# EAGLE board EPAPER133_V2 (EAGLE 9.7.0), part 1 of 2
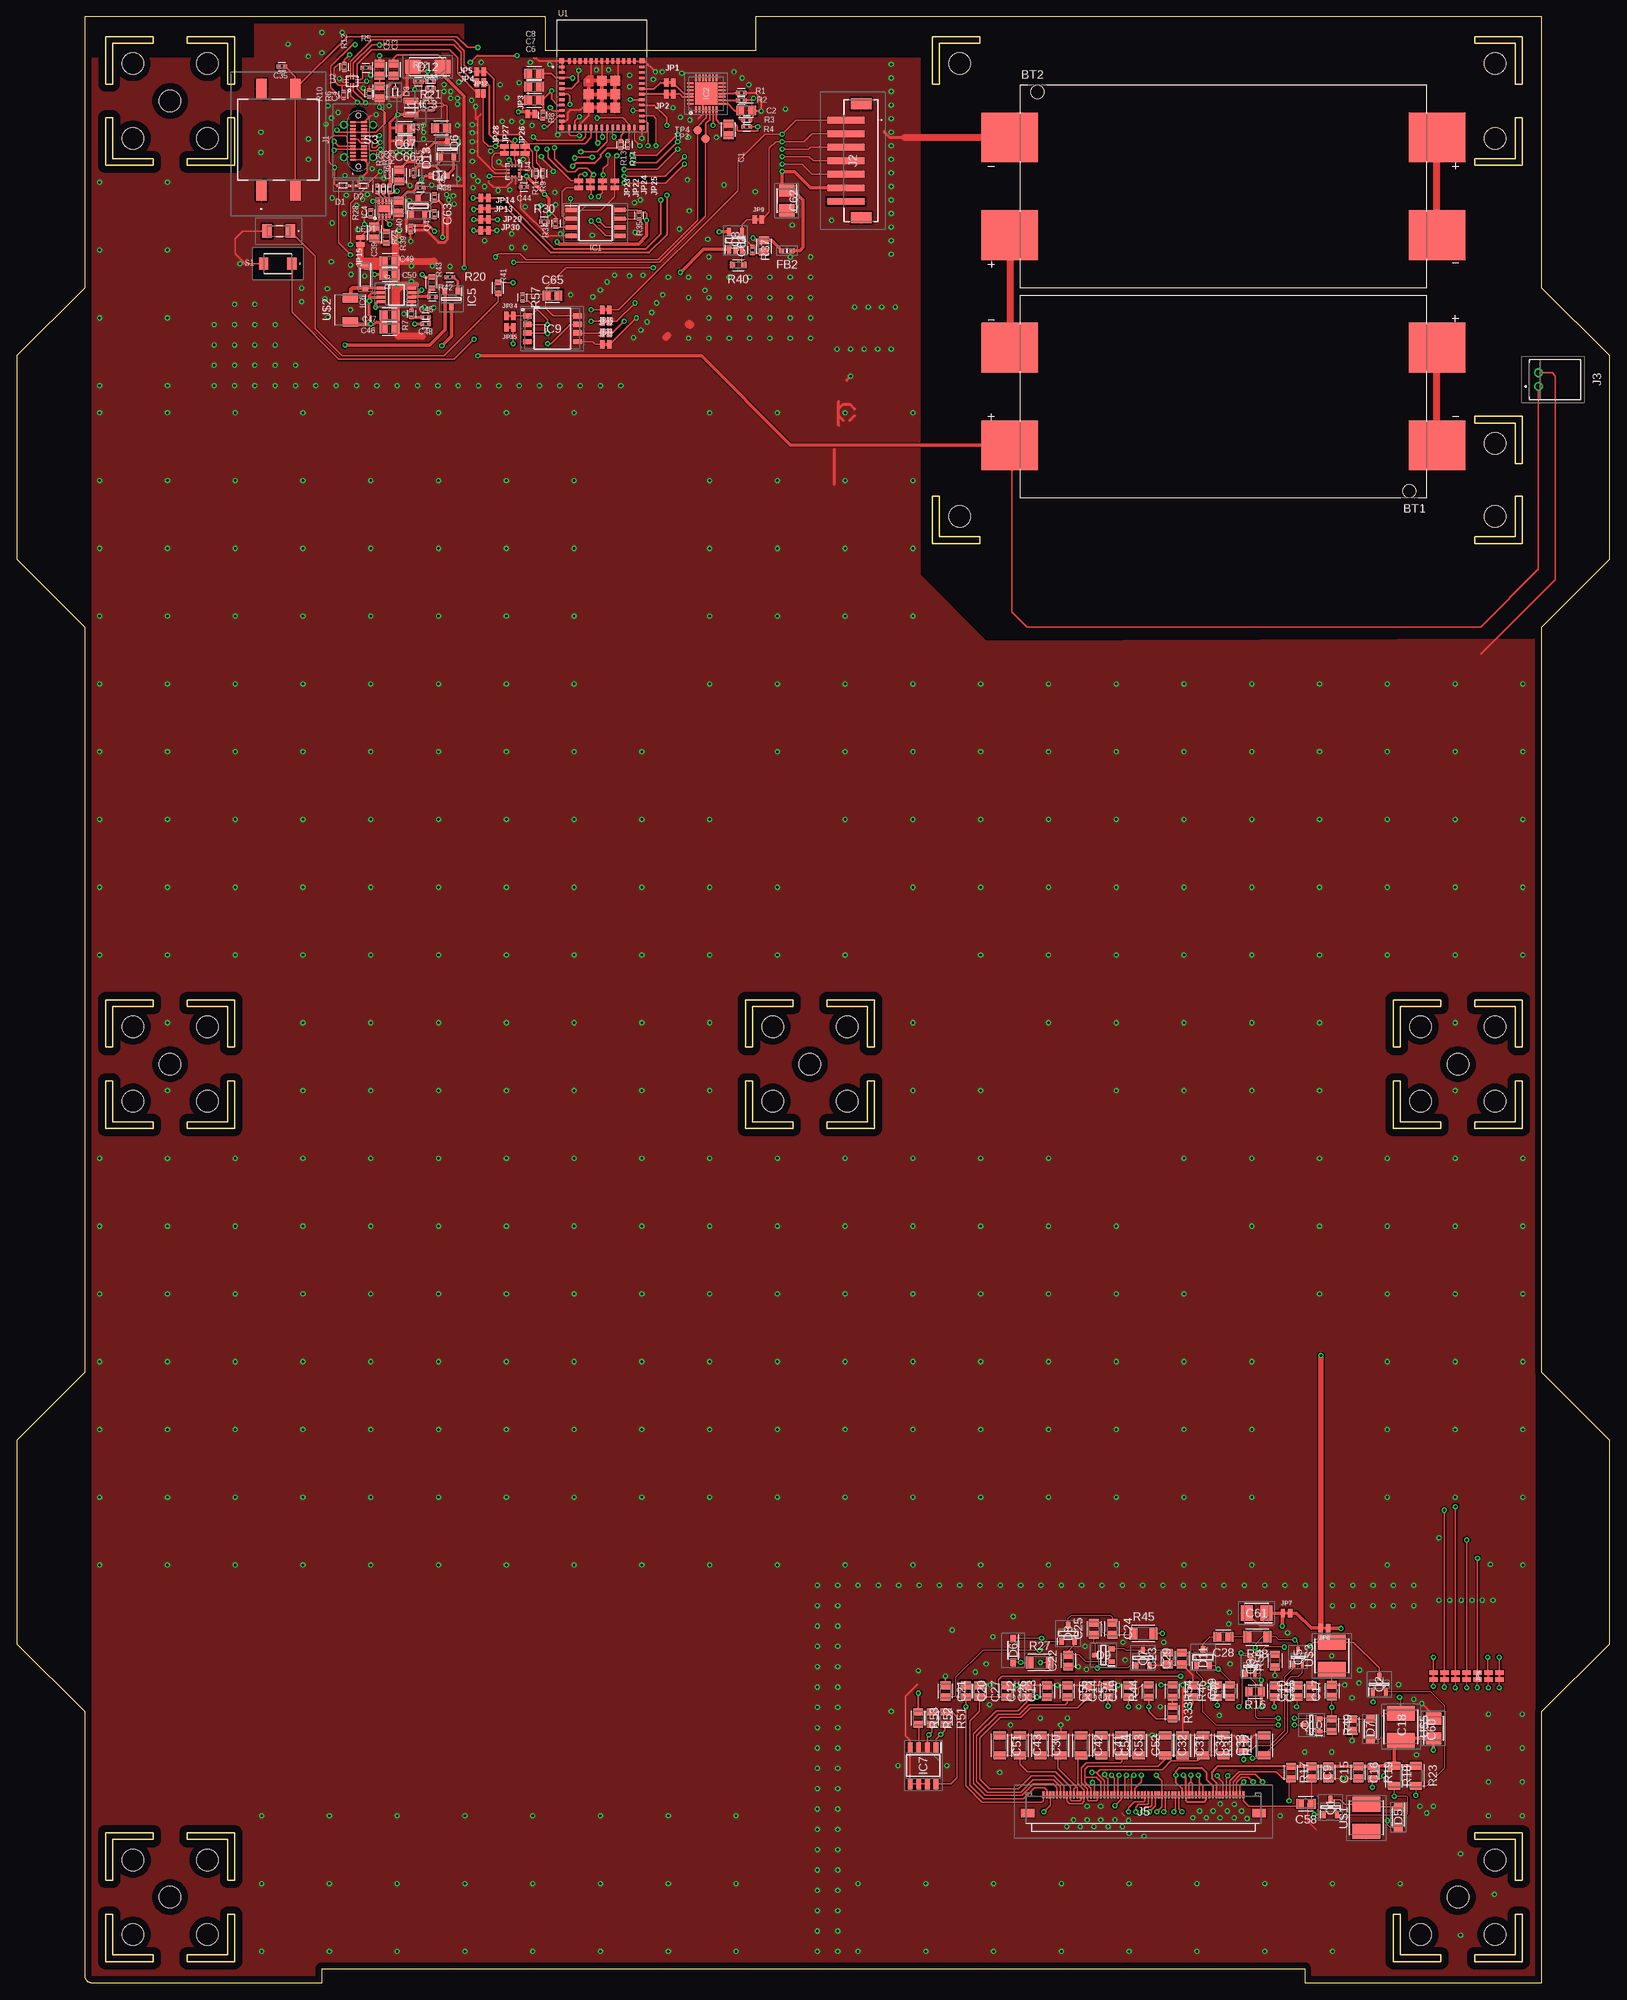
[diagram p2: board, top side]
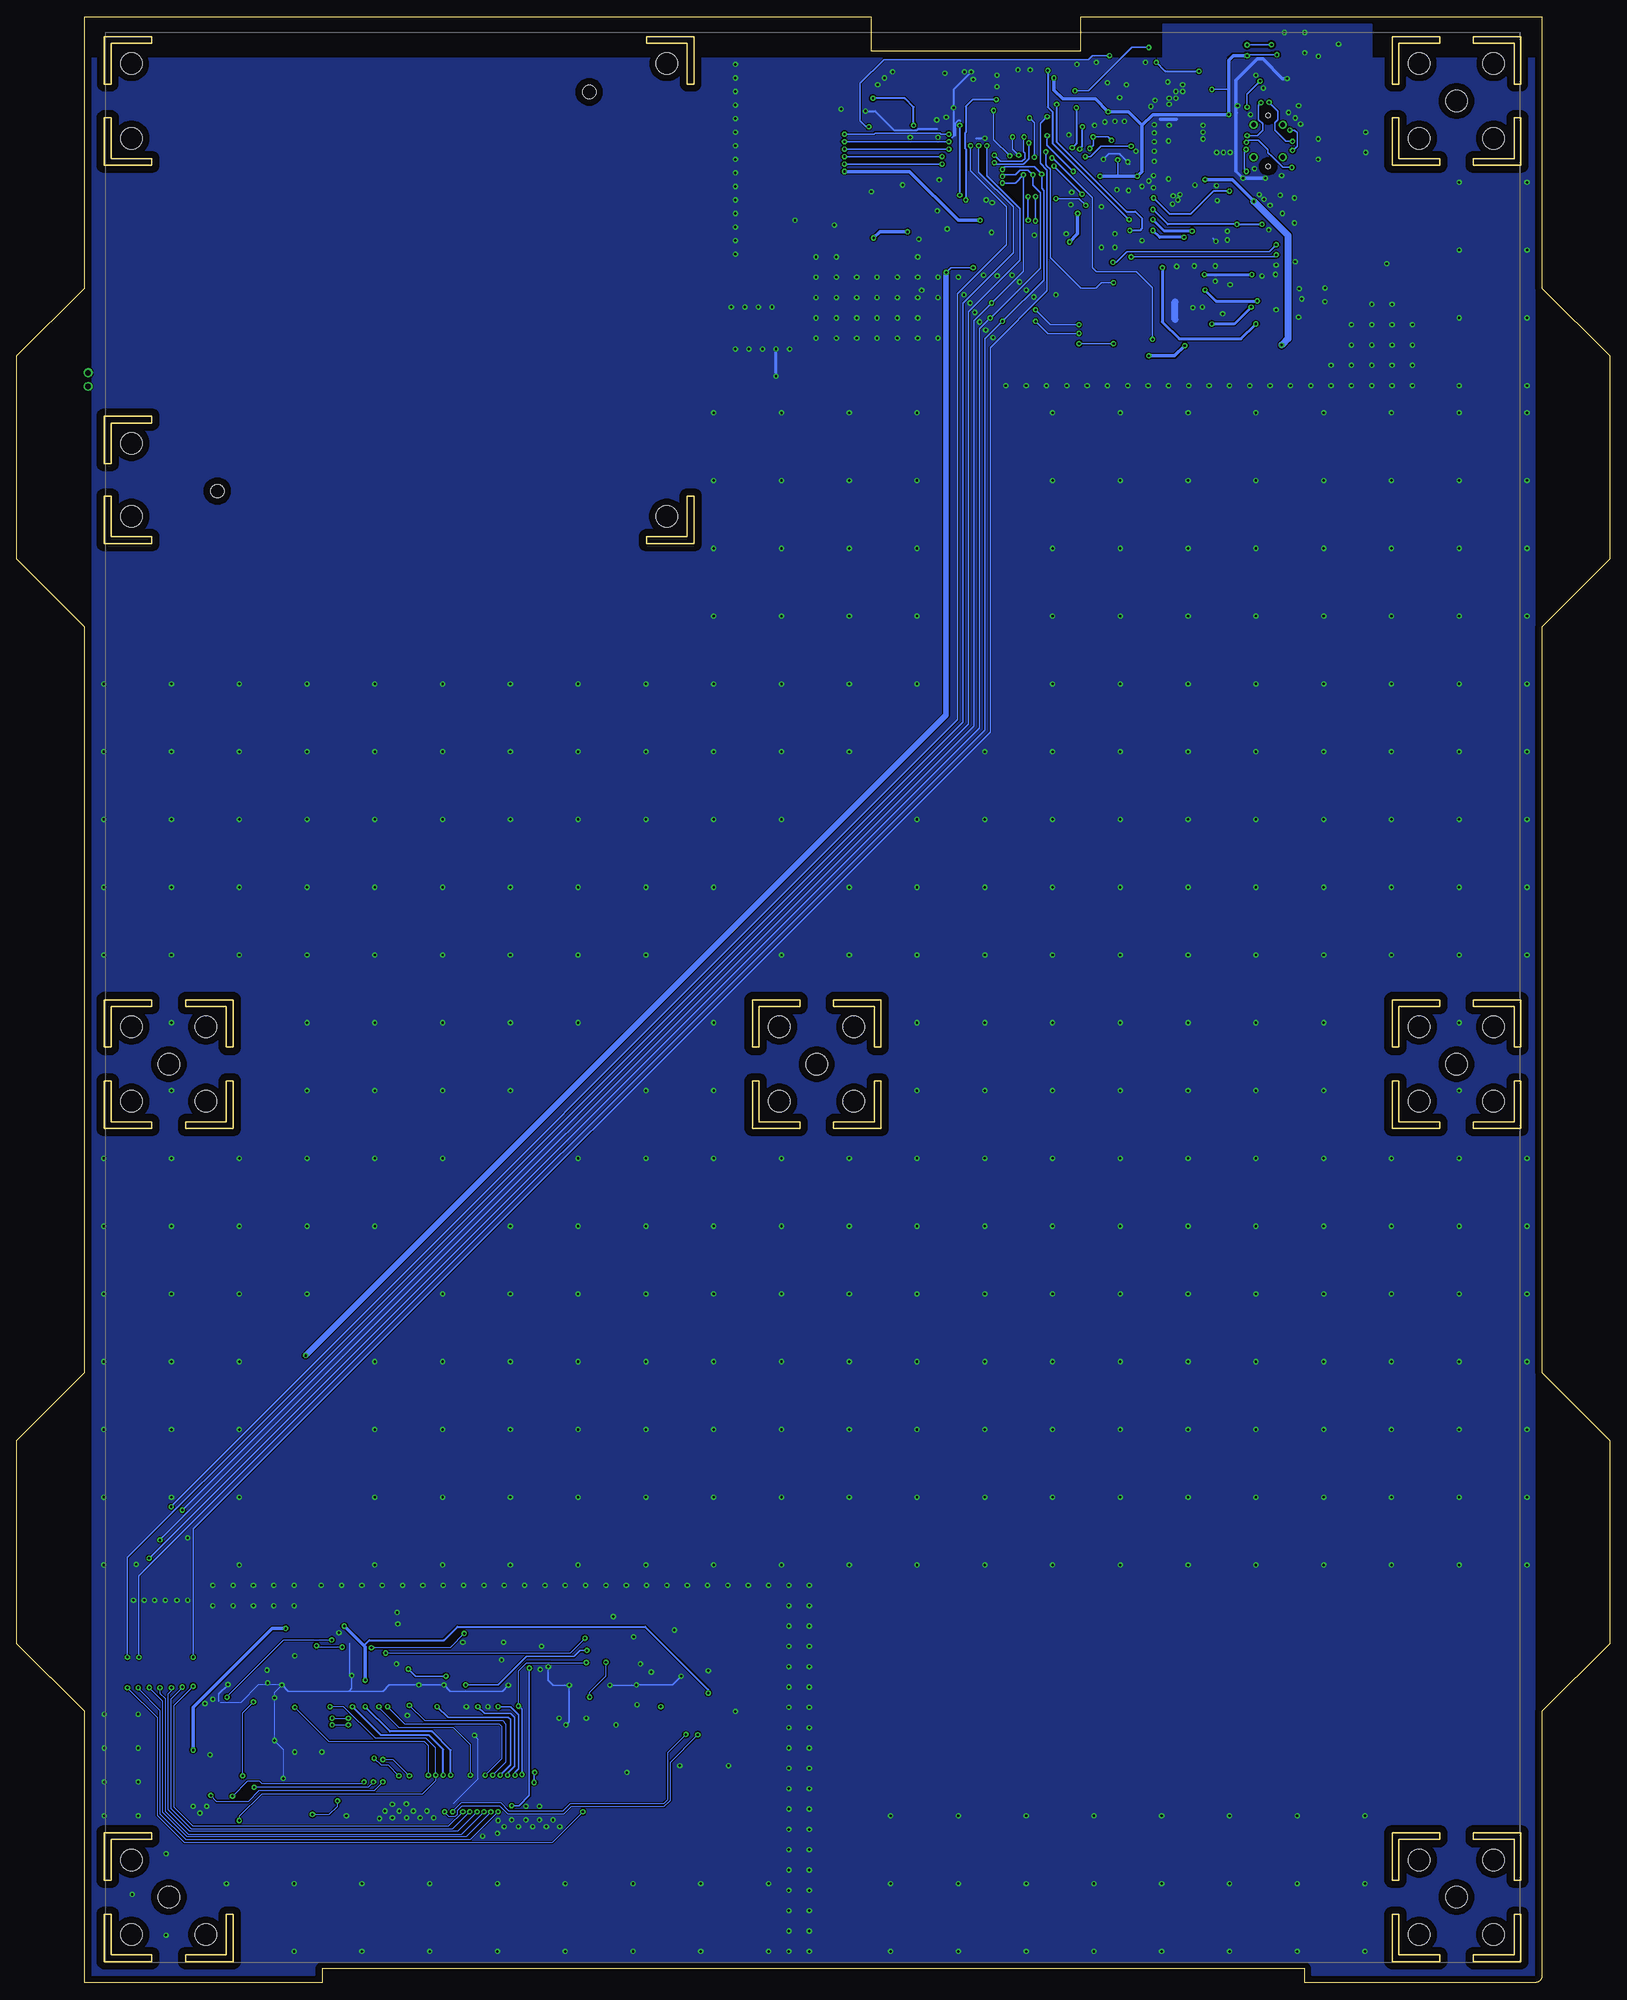
[diagram p3: board, bottom side, seen from below]

Size 235 x 290 mm. Coordinates in mm from the lower left corner, seen from the top.
Outline: 10,290 10,250 0,240 0,210 10,200 10,90 0,80 0,50 10,40 10,1 arc90 11,0 45,0 45,2 190,2 190,0 225,0 225,40 235,50 235,80 225,90 225,200 235,210 235,240 225,250 225,290 109,290 109,285 78,285 78,290 10,290
Outline: 107.5,145 114.5,145 114.5,144 108.5,144 108.5,138 107.5,138 107.5,145
Outline: 107.5,126 107.5,133 108.5,133 108.5,127 114.5,127 114.5,126 107.5,126
Outline: 126.5,145 126.5,138 125.5,138 125.5,144 119.5,144 119.5,145 126.5,145
Outline: 126.5,126 119.5,126 119.5,127 125.5,127 125.5,133 126.5,133 126.5,126
Outline: 32.1,22.1 32.1,15.1 31.1,15.1 31.1,21.1 25.1,21.1 25.1,22.1 32.1,22.1
Outline: 13.1,22.1 20.1,22.1 20.1,21.1 14.1,21.1 14.1,15.1 13.1,15.1 13.1,22.1
Outline: 32.1,3.1 25.1,3.1 25.1,4.1 31.1,4.1 31.1,10.1 32.1,10.1 32.1,3.1
Outline: 13.1,3.1 13.1,10.1 14.1,10.1 14.1,4.1 20.1,4.1 20.1,3.1 13.1,3.1
Outline: 222.1,22.1 222.1,15.1 221.1,15.1 221.1,21.1 215.1,21.1 215.1,22.1 222.1,22.1
Outline: 222.1,3.1 215.1,3.1 215.1,4.1 221.1,4.1 221.1,10.1 222.1,10.1 222.1,3.1
Outline: 203.1,3.1 203.1,10.1 204.1,10.1 204.1,4.1 210.1,4.1 210.1,3.1 203.1,3.1
Outline: 32.1,287.1 32.1,280.1 31.1,280.1 31.1,286.1 25.1,286.1 25.1,287.1 32.1,287.1
Outline: 13.1,287.1 20.1,287.1 20.1,286.1 14.1,286.1 14.1,280.1 13.1,280.1 13.1,287.1
Outline: 32.1,268.1 25.1,268.1 25.1,269.1 31.1,269.1 31.1,275.1 32.1,275.1 32.1,268.1
Outline: 13.1,268.1 13.1,275.1 14.1,275.1 14.1,269.1 20.1,269.1 20.1,268.1 13.1,268.1
Outline: 135.1,287.1 142.1,287.1 142.1,286.1 136.1,286.1 136.1,280.1 135.1,280.1 135.1,287.1
Outline: 222.1,268.1 215.1,268.1 215.1,269.1 221.1,269.1 221.1,275.1 222.1,275.1 222.1,268.1
Outline: 222.1,287.1 222.1,280.1 221.1,280.1 221.1,286.1 215.1,286.1 215.1,287.1 222.1,287.1
Outline: 222.1,212.3 215.1,212.3 215.1,213.3 221.1,213.3 221.1,219.3 222.1,219.3 222.1,212.3
Outline: 135.1,212.3 135.1,219.3 136.1,219.3 136.1,213.3 142.1,213.3 142.1,212.3 135.1,212.3
Outline: 13.1,145 20.1,145 20.1,144 14.1,144 14.1,138 13.1,138 13.1,145
Outline: 13.1,126 13.1,133 14.1,133 14.1,127 20.1,127 20.1,126 13.1,126
Outline: 32.1,145 32.1,138 31.1,138 31.1,144 25.1,144 25.1,145 32.1,145
Outline: 32.1,126 25.1,126 25.1,127 31.1,127 31.1,133 32.1,133 32.1,126
Outline: 203.1,145 210.1,145 210.1,144 204.1,144 204.1,138 203.1,138 203.1,145
Outline: 203.1,126 203.1,133 204.1,133 204.1,127 210.1,127 210.1,126 203.1,126
Outline: 222.1,145 222.1,138 221.1,138 221.1,144 215.1,144 215.1,145 222.1,145
Outline: 222.1,126 215.1,126 215.1,127 221.1,127 221.1,133 222.1,133 222.1,126
Outline: 222.1,231.1 222.1,224.1 221.1,224.1 221.1,230.1 215.1,230.1 215.1,231.1 222.1,231.1
Copper layers (1*16): Top / Bottom
Stack-up Default Layer Stack: Top User Defined 0.035mm / Dielectric-1 User Defined 1.5mm / Bottom User Defined 0.035mm
Design rules: minimum copper width 6mil, minimum drill size 0.35mm, copper clearance wire_polygon to wire_polygon 6mil, copper clearance wire_polygon to pad_smd 6mil, copper clearance wire_polygon to via 0.15mm, copper clearance pad_smd to pad_smd 6mil, copper clearance pad_smd to via 6mil, copper clearance via to via 6mil, copper clearance smd to pad (same net) 6mil, copper clearance smd to via (same net) 6mil, copper clearance smd to smd (same net) 6mil, dimension clearance 40mil, via restrict clearance 0mil, restrict clearance 0mil, drill distance 6mil, keepout clearance 0mil
Holes 3.2 mm at 111.5,141 122.5,141 122.5,130 111.5,130 117,135.5 28.1,18.1 28.1,7.1 17.1,7.1 17.1,18.1 22.6,12.6 218.1,18.1 218.1,7.1 207.1,7.1 212.6,12.6 28.1,283.1 28.1,272.1 17.1,272.1 17.1,283.1 22.6,277.6 139.1,283.1 218.1,283.1 218.1,272.1 218.1,216.3 139.1,216.3 17.1,141 28.1,141 28.1,130 17.1,130 22.6,135.5 207.1,141 218.1,141 218.1,130 207.1,130 212.6,135.5 218.1,227.1

## Footprints (pad centres in the part's own frame; a part is rotated, then mirrored left to right if it is on the bottom)
BAT_1012 = smd 8.34 x 7.35: N1 -31.5,7.21; N2 31.5,-7.21; P1 31.5,7.21; P2 -31.5,-7.21 | hole 1.98: -27.435,13.94
CAPC2012X110 = smd 1.165 x 1.465: 1 -0.875,0; 2 0.875,0
CAPC3216X135 = smd 1.165 x 1.815: 1 -1.475,0; 2 1.475,0
CAPC1005X60 = smd 0.56 x 0.629: 1 -0.485,0; 2 0.485,0
CAPPM3528X210N = smd 1.8 x 2.3: 1 -1.45,0; 2 1.45,0
LESD5D50CT1G = smd 0.48 x 0.4: 1 -0.66,0; 2 0.66,0
CUS357H3F = smd 0.8 x 0.9: 1 -1.15,0; 2 1.15,0
SODFL3518X115N = smd 1.12 x 1.37: 1 -1.5,0; 2 1.5,0
SOD3716X135N = smd 1.15 x 0.8: 1 -1.75,0; 2 1.75,0
SOT95P240X120-3N = smd 1 x 0.7: 1 -1.2,0.95; 2 -1.2,-0.95; 3 1.2,0
SODFL3516X120N = smd 0.82 x 0.76: 1 -1.6,0; 2 1.6,0
DIOM5327X244N = smd 2.3 x 2.05: 1 -2.2,0; 2 2.2,0
BLM18SP221SN1B = smd 0.75 x 0.7: 1 -0.775,0; 2 0.775,0
SOIC127P790X216-8N = smd 1.65 x 0.65: 1 -3.6,1.905; 2 -3.6,0.635; 3 -3.6,-0.635; 4 -3.6,-1.905; 5 3.6,-1.905; 6 3.6,-0.635; 7 3.6,0.635; 8 3.6,1.905
QFN50P500X500X80-29N = smd 1 x 0.3: 1 -2.35,1.5; 2 -2.35,1; 3 -2.35,0.5; 4 -2.35,0; 5 -2.35,-0.5; 6 -2.35,-1; 7 -2.35,-1.5; 15 2.35,-1.5; 16 2.35,-1; 17 2.35,-0.5; 18 2.35,0; 19 2.35,0.5; 20 2.35,1; 21 2.35,1.5 | smd 0.3 x 1: 8 -1.5,-2.35; 9 -1,-2.35; 10 -0.5,-2.35; 11 0,-2.35; 12 0.5,-2.35; 13 1,-2.35; 14 1.5,-2.35; 22 1.5,2.35; 23 1,2.35; 24 0.5,2.35; 25 0,2.35; 26 -0.5,2.35; 27 -1,2.35; 28 -1.5,2.35 | smd 3.35 x 3.35: 29 0,0
TPS62902RPJR = smd 0.65 x 0.2: 1 -0.625,0.25; 2 -0.625,-0.25; 3 -0.625,-0.75; 5 0.625,-0.25 | smd 1 x 0.2: 4 0.45,-0.75; 6 0.45,0.25 | smd 0.25 x 0.55: 7 0.5,0.925; 8 0,0.925; 9 -0.5,0.925
SON50P200X200X80-9N = smd 0.7 x 0.3: 1 -1.05,0.75; 2 -1.05,0.25; 3 -1.05,-0.25; 4 -1.05,-0.75; 5 1.05,-0.75; 6 1.05,-0.25; 7 1.05,0.25; 8 1.05,0.75 | smd 1 x 1.7: 9 0,0
SOT96P240X115-3N = smd 1.15 x 0.6: 1 -1.1,0.96; 2 -1.1,-0.96; 3 1.1,0
SOP65P490X110-8N = smd 1.4 x 0.45: 1 -2.2,0.975; 2 -2.2,0.325; 3 -2.2,-0.325; 4 -2.2,-0.975; 5 2.2,-0.975; 6 2.2,-0.325; 7 2.2,0.325; 8 2.2,0.975
SOIC127P600X175-8N = smd 1.55 x 0.7: 1 -2.7,1.905; 2 -2.7,0.635; 3 -2.7,-0.635; 4 -2.7,-1.905; 5 2.7,-1.905; 6 2.7,-0.635; 7 2.7,0.635; 8 2.7,1.905
SOT95P280X135-5N = smd 1.25 x 0.6: 1 -1.3,0.95; 2 -1.3,0; 3 -1.3,-0.95; 4 1.3,-0.95; 5 1.3,0.95
SON127P800X600X80-8N = smd 1.3 x 0.8: 1 -3.7,1.905; 2 -3.7,0.635; 3 -3.7,-0.635; 4 -3.7,-1.905; 5 3.7,-1.905; 6 3.7,-0.635; 7 3.7,0.635; 8 3.7,1.905
U263241N4BQC02 = smd 0.3 x 0.85: A1 -2.75,0.835; A2 -2.25,0.835; A3 -1.75,0.835; A4 -1.25,0.835; A5 -0.75,0.835; A6 -0.25,0.835; A7 0.25,0.835; A8 0.75,0.835; A9 1.25,0.835; A10 1.75,0.835; A11 2.25,0.835; A12 2.75,0.835; B1 2.75,-0.835; B2 2.25,-0.835; B3 1.75,-0.835; B4 1.25,-0.835; B5 0.75,-0.835; B6 0.25,-0.835; B7 -0.25,-0.835; B8 -0.75,-0.835; B9 -1.25,-0.835; B10 -1.75,-0.835; B11 -2.25,-0.835; B12 -2.75,-0.835 | drill 0.7 pad 1.1: MH1 -2.4,2.15; MH2 2.4,2.15; MH3 2.4,-2.15; MH4 -2.4,-2.15 | hole 0.66: -3.75,0; 3.75,0
B7BPHSM4TBLFSN = smd 1 x 5.5: 1 6,2.75; 2 4,2.75; 3 2,2.75; 4 0,2.75; 5 -2,2.75; 6 -4,2.75; 7 -6,2.75 | smd 1.6 x 3: 8 8.4,0.5; 9 -8.4,0.5
S2BPHKS = drill 0.8 pad 1.3: 1 0,0; 2 -2,0
5051106091 = smd 0.3 x 1: 1 -14.75,2.1; 2 -14.25,2.1; 3 -13.75,2.1; 4 -13.25,2.1; 5 -12.75,2.1; 6 -12.25,2.1; 7 -11.75,2.1; 8 -11.25,2.1; 9 -10.75,2.1; 10 -10.25,2.1; 11 -9.75,2.1; 12 -9.25,2.1; 13 -8.75,2.1; 14 -8.25,2.1; 15 -7.75,2.1; 16 -7.25,2.1; 17 -6.75,2.1; 18 -6.25,2.1; 19 -5.75,2.1; 20 -5.25,2.1; 21 -4.75,2.1; 22 -4.25,2.1; 23 -3.75,2.1; 24 -3.25,2.1; 25 -2.75,2.1; 26 -2.25,2.1; 27 -1.75,2.1; 28 -1.25,2.1; 29 -0.75,2.1; 30 -0.25,2.1; 31 0.25,2.1; 32 0.75,2.1; 33 1.25,2.1; 34 1.75,2.1; 35 2.25,2.1; 36 2.75,2.1; 37 3.25,2.1; 38 3.75,2.1; 39 4.25,2.1; 40 4.75,2.1; 41 5.25,2.1; 42 5.75,2.1; 43 6.25,2.1; 44 6.75,2.1; 45 7.25,2.1; 46 7.75,2.1; 47 8.25,2.1; 48 8.75,2.1; 49 9.25,2.1; 50 9.75,2.1; 51 10.25,2.1; 52 10.75,2.1; 53 11.25,2.1; 54 11.75,2.1; 55 12.25,2.1; 56 12.75,2.1; 57 13.25,2.1; 58 13.75,2.1; 59 14.25,2.1; 60 14.75,2.1 | smd 2 x 1.3: MP1 -17.05,-0.6; MP2 17.05,-0.6
SMT-JUMPER_2_NC_TRACE_NO-SILK = smd 0.66 x 1.27: 1 -0.521,0; 2 0.521,0
SMT-JUMPER_2_NO_NO-SILK = smd 0.635 x 1.27: 1 -0.406,0; 2 0.406,0
DFE2HCAH1R0MJ0L = smd 0.85 x 2.2: 1 -1.025,0; 2 1.025,0
KPTD3216SGC = smd 1.4 x 2: 1 -1.7,0; 2 1.7,0
SOT65P210X110-3N = smd 1 x 0.5: 1 -1,0.65; 2 -1,-0.65; 3 1,0
SOT96P240X110-3N = smd 1.1 x 0.65: 1 -1.05,0.96; 2 -1.05,-0.96; 3 1.05,0
SOT95P230X110-3N = smd 1.05 x 0.6: 1 -1.1,0.95; 2 -1.1,-0.95; 3 1.1,0
RESC1005X40 = smd 0.535 x 0.644: 1 -0.507,0; 2 0.507,0
RESC2012X65 = smd 1.031 x 1.42: 1 -0.919,0; 2 0.919,0
RESC3216X70 = smd 1.165 x 1.815: 1 -1.475,0; 2 1.475,0
RESC1608X60 = smd 0.799 x 0.974: 1 -0.815,0; 2 0.815,0
TS1088AR02016 = smd 1.35 x 1.8: 1 -2.075,0; 2 2.075,0
TS1103SCU = smd 3 x 1.5: 1 -7.5,2.5; 2 7.5,2.5; 3 -7.5,-2.5; 4 7.5,-2.5
B1,27 = smd 1.27 x 1.27: TP 0,0
XCVR_ESP32-C6-MINI-1-N4 = smd 0.8 x 0.4: 1 -5.9,4; 2 -5.9,3.2; 3 -5.9,2.4; 4 -5.9,1.6; 5 -5.9,0.8; 6 -5.9,0; 7 -5.9,-0.8; 8 -5.9,-1.6; 9 -5.9,-2.4; 10 -5.9,-3.2; 11 -5.9,-4; 25 5.9,-4; 26 5.9,-3.2; 27 5.9,-2.4; 28 5.9,-1.6; 29 5.9,-0.8; 30 5.9,0; 31 5.9,0.8; 32 5.9,1.6; 33 5.9,2.4; 34 5.9,3.2; 35 5.9,4 | smd 0.4 x 0.8: 12 -4.8,-4.9; 13 -4,-4.9; 14 -3.2,-4.9; 15 -2.4,-4.9; 16 -1.6,-4.9; 17 -0.8,-4.9; 18 0,-4.9; 19 0.8,-4.9; 20 1.6,-4.9; 21 2.4,-4.9; 22 3.2,-4.9; 23 4,-4.9; 24 4.8,-4.9; 36 4.8,4.9; 37 4,4.9; 38 3.2,4.9; 39 2.4,4.9; 40 1.6,4.9; 41 0.8,4.9; 42 0,4.9; 43 -0.8,4.9; 44 -1.6,4.9; 45 -2.4,4.9; 46 -3.2,4.9; 47 -4,4.9; 48 -4.8,4.9 | smd 0.4 x 0.4: 49_1 -1.975,1.975 | smd 1.45 x 1.45: 49_2 0,1.975; 49_3 1.975,1.975; 49_4 -1.975,0; 49_5 0,0; 49_6 1.975,0; 49_7 -1.975,-1.975; 49_8 0,-1.975; 49_9 1.975,-1.975 | smd 0.7 x 0.7: 50 5.95,4.95; 51 5.95,-4.95; 52 -5.95,-4.95; 53 -5.95,4.95
X2QFN12 = smd 0.7 x 0.2: 1 -0.65,0.2; 2 -0.65,-0.2; 7 0.65,-0.2; 8 0.65,0.2 | smd 0.2 x 0.5: 3 -0.6,-0.75; 4 -0.2,-0.75; 5 0.2,-0.75; 6 0.6,-0.75; 9 0.6,0.75; 10 0.2,0.75; 11 -0.2,0.75; 12 -0.6,0.75
KIONIX_KXTJ3-1057 = smd 0.275 x 0.25: 1 -0.762,0.75; 2 -0.762,0.25; 3 -0.762,-0.25; 4 -0.762,-0.75; 7 0.762,-0.75; 8 0.762,-0.25; 9 0.762,0.25; 10 0.762,0.75 | smd 0.25 x 0.275: 5 -0.25,-0.762; 6 0.25,-0.762; 11 0.25,0.762; 12 -0.25,0.762
INDPM5050X400N = smd 2.2 x 4.1: 1 -2,0; 2 2,0
SL0420-3R3M = smd 1.4 x 2.3: 1 -1.775,0; 2 1.775,0

## Placement (x,y rotation side)
BT1  1012  [BAT_1012]  178,234 180 top
BT2  1012  [BAT_1012]  178,265 0 top
C1  10uF 25V 0805  [CAPC2012X110]  105,273.4 270 top
C2  1uF 25V 0805  [CAPC2012X110]  107.6,276.2 0 top
C3  10uF 25V 0805  [CAPC2012X110]  55.6,282.2 270 top
C4  4.7uF 25V 0805  [CAPC2012X110]  53.5,278.9 90 top
C5  4.7uF 25V 0805  [CAPC2012X110]  53.5,282.2 270 top
C6  1uF 25V 0805  [CAPC2012X110]  76.3,277.7 180 top
C7  100nF 50V 0805  [CAPC2012X110]  76.3,279.7 0 top
C8  10uF 25V 0805  [CAPC2012X110]  76.3,281.6 0 top
C9  4.7uF 25V 0805  [CAPC2012X110]  191,31 270 top
C10  10uF 50V 0805  [CAPC2012X110]  188.9,43 90 top
C11  100nF 50V 0805  [CAPC2012X110]  191,43 90 top
C12  10uF 50V 0805  [CAPC2012X110]  149,43 90 top
C13  100nF 50V 0805  [CAPC2012X110]  152,43 90 top
C14  100nF 50V 0805  [CAPC2012X110]  161,43 90 top
C15  4.7uF 25V 0805  [CAPC2012X110]  193.5,31 270 top
C16  4.7uF 25V 0805  [CAPC2012X110]  197.9,31 270 top
C17  10uF 50V 0805  [CAPC2012X110]  194,43.07 90 top
C18  100nF 50V 0805  [CAPC2012X110]  197,38 270 top
C19  1uF 50V 0805  [CAPC2012X110]  164,43 90 top
C20  100nF 50V 0805  [CAPC2012X110]  140,43 270 top
C21  4.7uF 50V 0805  [CAPC2012X110]  137,43 270 top
C22  1uF 50V 0805  [CAPC2012X110]  155.1,47.5 90 top
C23  47nF 50V 0805  [CAPC2012X110]  169.8,47.8 90 top
C24  470nF 50V 0805  [CAPC2012X110]  161.6,52.2 270 top
C25  470nF 50V 0805  [CAPC2012X110]  158.9,52.2 90 top
C26  100nF 50V 0805  [CAPC2012X110]  146,43 270 top
C27  4.7uF 25V 0805  [CAPC2012X110]  142,43 270 top
C28  470nF 50V 0805  [CAPC2012X110]  178,51 180 top
C29  220nF 50V 0805  [CAPC2012X110]  171.9,47.8 90 top
C30  22uF 25V 1206  [CAPC3216X135]  151,35 270 top
C31  22uF 25V 1206  [CAPC3216X135]  172,35 270 top
C32  22uF 25V 1206  [CAPC3216X135]  169.4,35 270 top
C33  22uF 25V 1206  [CAPC3216X135]  178,35 270 top
C34  22uF 25V 1206  [CAPC3216X135]  175,35 270 top
C35  100nF 25V 0402  [CAPC1005X60]  39.1,282.7 180 top
C36  4.7uF 25V 0805  [CAPC2012X110]  56.4,266.6 90 top
C37  10uF 25V 0805  [CAPC2012X110]  62.6,273.6 0 top
C38  3.3pF 10V 0402  [CAPC1005X60]  61,279.5 0 top
C39  1uF 25V 0805  [CAPC2012X110]  52.7,258.2 90 top
C40  1uF 25V 0805  [CAPC2012X110]  56.3,262 90 top
C41  22uF 25V 1206  [CAPC3216X135]  160,35 270 top
C42  22uF 25V 1206  [CAPC3216X135]  157,35 270 top
C43  22uF 25V 1206  [CAPC3216X135]  148,35 270 top
C44  100nF 25V 0402  [CAPC1005X60]  74.82,264.9 180 top
C45  1nF 25V 0402  [CAPC1005X60]  60.3,245.7 0 top
C46  10uF 25V 0805  [CAPC2012X110]  55,244 0 top
C47  1uF 25V 0805  [CAPC2012X110]  55,246 0 top
C48  100nF 25V 0402  [CAPC1005X60]  60.3,244.7 0 top
C49  10uF 25V 0805  [CAPC2012X110]  55,254 0 top
C50  10uF 25V 0805  [CAPC2012X110]  55,252 0 top
C51  22uF 25V 1206  [CAPC3216X135]  145,35 270 top
C52  22uF 25V 1206  [CAPC3216X135]  165.5,35 270 top
C53  22uF 25V 1206  [CAPC3216X135]  163,35 270 top
C54  22uF 25V 1206  [CAPC3216X135]  154,35 270 top
C55  10uF 50V 0805  [CAPC2012X110]  185.6,43 270 top
C56  4.7uF 25V 0805  [CAPC2012X110]  155,43 270 top
C57  470nF 50V 0805  [CAPC2012X110]  157.9,43 270 top
C58  470nF 50V 0805  [CAPC2012X110]  190.2,26.4 180 top
C59  470nF 50V 0805  [CAPC2012X110]  173.5,43 270 top
C60  TAJB107K006RNJ  [CAPPM3528X210N]  209,37.5 90 top
C61  TAJB107K006RNJ  [CAPPM3528X210N]  182.9,54.5 180 top
C62  TLJB227M006R0500  [CAPPM3528X210N]  113.6,262.9 270 top
C63  1nF 25V 0402  [CAPC1005X60]  61.6,260.9 270 top
C64  10uF 50V 0805  [CAPC2012X110]  110.2,256.2 90 top
C65  1uF 25V 0805  [CAPC2012X110]  79,248.9 0 top
C66  10uF 25V 0805  [CAPC2012X110]  57.3,271.7 180 top
C67  10uF 25V 0805  [CAPC2012X110]  57.3,273.6 180 top
D1  LESD5D5.0CT1G  [LESD5D50CT1G]  48.1,265.1 180 top
D2  LESD5D5.0CT1G  [LESD5D50CT1G]  51.1,265.1 0 top
D3  LESD5D5.0CT1G  [LESD5D50CT1G]  55.8,278.9 270 top
D4  CUS08F30  [CUS357H3F]  62.3,266.6 180 top
D5  MBR230S1F-7  [SODFL3518X115N]  203.8,24.4 270 top
D6  MBR0530  [SOD3716X135N]  147,49 270 top
D7  MBR230S1F-7  [SODFL3518X115N]  199.7,37.4 270 top
D8  BAT54S  [SOT95P240X120-3N]  155.1,51.5 90 top
D9  BAT54S  [SOT95P240X120-3N]  160.3,48.3 180 top
D10  PMEG2010AEH  [SODFL3516X120N]  51.4,251.6 270 top
D11  BAT54S  [SOT95P240X120-3N]  175,48 90 top
D12  SS34  [DIOM5327X244N]  60.6,282.64 180 top
D13  CUS08F30  [CUS357H3F]  60.4,269.15 270 top
FB2  BLM18PG221SH1D  [BLM18SP221SN1B]  113.6,255.5 180 top
IC1  W25Q128JVSIQ  [SOIC127P790X216-8N]  85.4,259.6 0 top
IC2  CP2102N-A02-GQFN28R  [QFN50P500X500X80-29N]  101.7,278.7 90 top
IC3  TPS62902RPJR  [TPS62902RPJR]  60.66,277 0 top
IC4  BQ25172DSGR  [SON50P200X200X80-9N]  54.2,261.7 90 top
IC5  DMP2035U  [SOT96P240X115-3N]  64.1,248.4 270 top
IC6  TPS61085DGKR  [SOP65P490X110-8N]  56,249 180 top
IC7  TCN75AVOA713  [SOIC127P600X175-8N]  133.7,32 270 top
IC8  MT9700  [SOT95P280X135-5N]  106,257 90 top
IC9  MKDV1GCL-AB  [SON127P800X600X80-8N]  79,244 0 top
J1  U263-241N-4BQC02  [U263241N4BQC02]  50.39,271.71 90 top
J2  B7B-PH-SM4-TB_LF__SN_  [B7BPHSM4TBLFSN]  125.06,268.78 90 top
J3  S2B-PH-K-S  [S2BPHKS]  224.5,235.5 270 top
J5  505110-6091  [5051106091]  166.2,25.6 0 top
JP1  NC  [SMT-JUMPER_2_NC_TRACE_NO-SILK]  96.3,280.33 0 top
JP2  NC  [SMT-JUMPER_2_NC_TRACE_NO-SILK]  96.3,278.6 0 top
JP3  NC  [SMT-JUMPER_2_NC_TRACE_NO-SILK]  75.9,275.7 180 top
JP4  NC  [SMT-JUMPER_2_NC_TRACE_NO-SILK]  68.4,280.3 0 top
JP5  NC  [SMT-JUMPER_2_NC_TRACE_NO-SILK]  68.4,281.92 0 top
JP6  NC  [SMT-JUMPER_2_NC_TRACE_NO-SILK]  192.9,52.3 180 top
JP7  NC  [SMT-JUMPER_2_NC_TRACE_NO-SILK]  187.3,54.5 0 top
JP8  NC  [SMT-JUMPER_2_NC_TRACE_NO-SILK]  217.11,45.2 90 top
JP9  NC  [SMT-JUMPER_2_NC_TRACE_NO-SILK]  109.4,260.1 0 top
JP10  NC  [SMT-JUMPER_2_NC_TRACE_NO-SILK]  86.9,246.8 180 top
JP12  NC  [SMT-JUMPER_2_NO_NO-SILK]  68.4,278.7 0 top
JP13  NC  [SMT-JUMPER_2_NC_TRACE_NO-SILK]  69,261.7 0 top
JP14  NC  [SMT-JUMPER_2_NC_TRACE_NO-SILK]  69,263.3 0 top
JP15  NC  [SMT-JUMPER_2_NC_TRACE_NO-SILK]  50.67,256.93 90 top
JP16  NC  [SMT-JUMPER_2_NC_TRACE_NO-SILK]  209,45.2 90 top
JP17  NC  [SMT-JUMPER_2_NC_TRACE_NO-SILK]  210.62,45.2 90 top
JP18  NC  [SMT-JUMPER_2_NC_TRACE_NO-SILK]  218.73,45.2 90 top
JP19  NC  [SMT-JUMPER_2_NC_TRACE_NO-SILK]  212.24,45.2 90 top
JP20  NC  [SMT-JUMPER_2_NC_TRACE_NO-SILK]  213.87,45.2 90 top
JP21  NC  [SMT-JUMPER_2_NC_TRACE_NO-SILK]  215.49,45.2 90 top
JP22  NC  [SMT-JUMPER_2_NC_TRACE_NO-SILK]  84.6,265.3 90 top
JP23  NC  [SMT-JUMPER_2_NC_TRACE_NO-SILK]  82.9,265.3 90 top
JP24  NC  [SMT-JUMPER_2_NC_TRACE_NO-SILK]  86.4,265.3 90 top
JP25  NC  [SMT-JUMPER_2_NC_TRACE_NO-SILK]  88.2,265.3 90 top
JP26  NC  [SMT-JUMPER_2_NC_TRACE_NO-SILK]  74.98,270.4 90 top
JP27  NC  [SMT-JUMPER_2_NC_TRACE_NO-SILK]  73.46,270.4 90 top
JP28  NC  [SMT-JUMPER_2_NC_TRACE_NO-SILK]  71.93,270.4 90 top
JP29  NC  [SMT-JUMPER_2_NC_TRACE_NO-SILK]  69,260.1 0 top
JP30  NC  [SMT-JUMPER_2_NC_TRACE_NO-SILK]  69,258.5 180 top
JP31  NC  [SMT-JUMPER_2_NC_TRACE_NO-SILK]  86.9,245.1 180 top
JP32  NC  [SMT-JUMPER_2_NC_TRACE_NO-SILK]  86.9,243.4 0 top
JP33  NC  [SMT-JUMPER_2_NC_TRACE_NO-SILK]  86.9,241.7 0 top
JP34  NC  [SMT-JUMPER_2_NC_TRACE_NO-SILK]  72.7,245.9 0 top
JP35  NC  [SMT-JUMPER_2_NC_TRACE_NO-SILK]  72.7,244.2 180 top
L1  DFE252012F-1R0M=P2  [DFE2HCAH1R0MJ0L]  58.19,276.62 270 top
LED1  KPTD-3216SGC  [KPTD3216SGC]  38.62,258.4 180 top
Q1  DMP3068L-7  [SOT96P240X115-3N]  193.8,25.87 90 top
Q2  DMP3068L-7  [SOT96P240X115-3N]  201,44 90 top
Q4  BSS138  [SOT95P240X120-3N]  59.2,262.1 90 top
Q5  DMN3065LW-7  [SOT65P210X110-3N]  189,48 90 top
Q6  DMP3056L-7  [SOT96P240X110-3N]  63.5,270.5 90 top
Q7  MMBT3904  [SOT95P230X110-3N]  166.14,47.91 90 top
Q8  DMN3065LW-7  [SOT65P210X110-3N]  182,46.64 90 top
Q10  MMBT3906  [SOT95P230X110-3N]  191,38 180 top
R1  NC  [RESC1005X40]  106.9,278.8 0 top
R2  1KΩ 0402  [RESC1005X40]  106.9,277.7 0 top
R3  47KΩ 0402  [RESC1005X40]  107.7,274.8 180 top
R4  22KΩ 0402  [RESC1005X40]  107.7,273.8 180 top
R5  820KΩ 0402  [RESC1005X40]  51.5,282.5 180 top
R6  820KΩ 0402  [RESC1005X40]  52,278.7 270 top
R7  30KΩ 0402  [RESC1005X40]  58.2,246.2 90 top
R8  10KΩ 0402  [RESC1005X40]  77.6,275.5 270 top
R9  10KΩ 0402  [RESC1005X40]  77.5,266.9 90 top
R10  10KΩ 0402  [RESC1005X40]  48.2,278.5 270 top
R11  10KΩ 0402  [RESC1005X40]  76.6,266.9 90 top
R12  10KΩ 0402  [RESC1005X40]  48.3,282.6 270 top
R13  10KΩ 0402  [RESC1005X40]  89.1,271.15 90 top
R14  10KΩ 0402  [RESC1005X40]  90.1,271.16 90 top
R15  10KΩ 0402  [RESC1005X40]  58.6,267 90 top
R16  2KΩ 0805  [RESC2012X65]  182.7,42.92 180 top
R17  1MΩ 0805  [RESC2012X65]  188,31 270 top
R18  0.2Ω 1206  [RESC3216X70]  203.2,30.5 270 top
R19  1MΩ 0805  [RESC2012X65]  200,31 270 top
R20  100KΩ 0402  [RESC1005X40]  63.9,251.6 180 top
R21  24.9KΩ 0402  [RESC1005X40]  61,280.5 180 top
R22  113KΩ 0402  [RESC1005X40]  59.2,280.5 180 top
R23  0.2Ω 1206  [RESC3216X70]  206.4,30.5 270 top
R24  1.2KΩ 0603  [RESC1608X60]  54.5,257.5 90 top
R25  11KΩ 0402  [RESC1005X40]  53.2,264.6 270 top
R26  36KΩ 0402  [RESC1005X40]  54.1,264.6 270 top
R27  0Ω 1206  [RESC3216X70]  150.9,47.2 0 top
R28  10KΩ 0402  [RESC1005X40]  52.2,261 270 top
R29  10KΩ 0402  [RESC1005X40]  55,264.6 270 top
R30  10KΩ 0402  [RESC1005X40]  77.8,259.8 0 top
R31  1MΩ 0805  [RESC2012X65]  181,35 90 top
R32  0.2Ω 1206  [RESC3216X70]  184,35 90 top
R33  200kΩ 0805  [RESC2012X65]  170.5,39.8 270 top
R34  10KΩ 0402  [RESC1005X40]  79.5,259.5 90 top
R35  10KΩ 0402  [RESC1005X40]  91.8,260.7 270 top
R36  10KΩ 0402  [RESC1005X40]  61.6,263.4 90 top
R37  100KΩ 0402  [RESC1005X40]  108.5,255.6 270 top
R38  560KΩ 0402  [RESC1005X40]  59.5,264.8 0 top
R39  100KΩ 0402  [RESC1005X40]  58.1,258.7 270 top
R40  3.9KΩ 0603  [RESC1608X60]  106.4,253.4 180 top
R41  2kΩ 0603  [RESC1608X60]  71,250 270 top
R42  18KΩ 0402  [RESC1005X40]  61.3,248.7 0 top
R43  75kΩ 0603  [RESC1608X60]  61.2,250.8 270 top
R44  16kΩ 0805  [RESC2012X65]  167,43 90 top
R45  2.2Ω 1206  [RESC3216X70]  166.2,51.5 0 top
R46  4.3kΩ 0805  [RESC2012X65]  177.1,43 90 top
R47  110kΩ 0805  [RESC2012X65]  179,43 90 top
R48  2.2Ω 1206  [RESC3216X70]  183,51 180 top
R49  100kΩ 0805  [RESC2012X65]  194,38 270 top
R50  1.5kΩ 0805  [RESC2012X65]  185.6,47.5 90 top
R51  4.3kΩ 0805  [RESC2012X65]  137,39 270 top
R52  4.3kΩ 0805  [RESC2012X65]  135,39 270 top
R53  4.3kΩ 0805  [RESC2012X65]  133,39 270 top
R54  200kΩ 0805  [RESC2012X65]  170.5,43 270 top
R57  100KΩ 0402  [RESC1005X40]  74.6,248.6 270 top
S1  TS-1088-AR02016  [TS1088AR02016]  38.5,253.6 180 top
S3  TS-1103S-C-U (C318914)  [TS1103SCU]  38.58,271.88 90 top
TP3  TPB1,27  [B1,27]  101.62,272 0 top
TP4  TPB1,27  [B1,27]  100.4,273.3 0 top
U1  ESP32-C6-MINI-1-N4  [XCVR_ESP32-C6-MINI-1-N4]  86.3,278.6 0 top
U2  FUSB303TMX  [X2QFN12]  49.44,280.53 90 top
U4  KXTJ3-1057  [KIONIX_KXTJ3-1057]  73.3,267.2 270 top
U$1  15 uH SWPA5040S150MT  [INDPM5050X400N]  199.1,24.3 90 top
U$2  3.3uH 1.5A  [SL0420-3R3M]  49.2,246.8 90 top
U$3  15 uH SWPA5040S150MT  [INDPM5050X400N]  194,48.2 90 top
U$5  15 uH SWPA5040S150MT  [INDPM5050X400N]  204.2,37.75 270 top